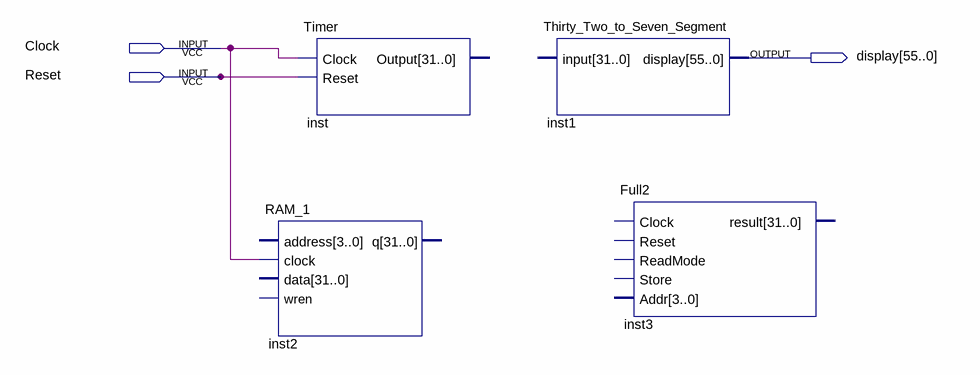
[diagram p0: schematic sheet]
// Quartus schematic FullSystem.bdf as structural Verilog: 4 symbols, 3 pins
module FullSystem (
  input  Clock,
  input  Reset,
  output [55:0] display
);

  Timer inst (.Clock(Clock), .Reset(Reset));  // open: Output
  RAM_1 inst2 (.clock(Clock));  // open: address, data, wren, q
  Thirty_Two_to_Seven_Segment inst1 (.display(display));  // open: input
  Full2 inst3 ();  // open: Clock, Reset, ReadMode, Store, Addr, result
endmodule
